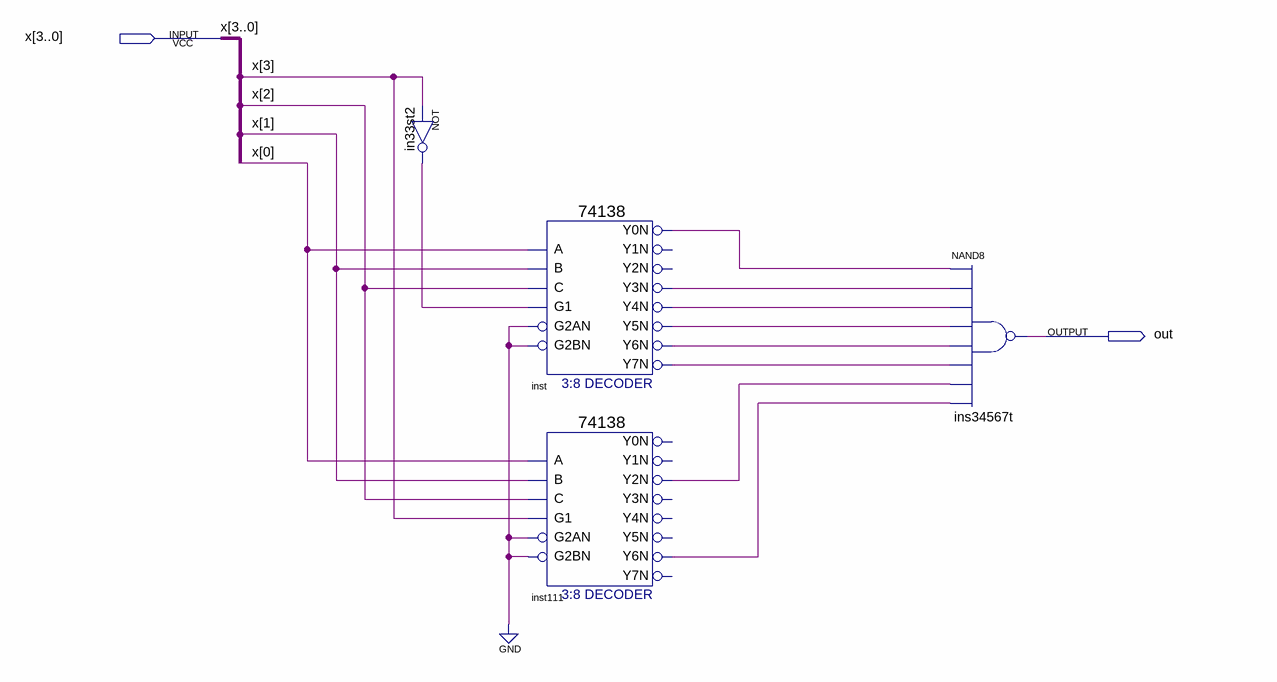
[diagram p0: schematic sheet]
// Quartus schematic Pract2.bdf as structural Verilog: 4 symbols, 2 pins
module Pract2 (
  input  [3:0] x,
  output out
);

  wire in33st2_out, inst111_y2n, inst111_y6n, inst_y0n, inst_y3n, inst_y4n, inst_y5n, inst_y6n, inst_y7n;

  not in33st2 (in33st2_out, x[3]);
  \74138  inst (
    .A(x[0]), .B(x[1]), .G1(in33st2_out), .C(x[2]), .G2AN(1'b0), .G2BN(1'b0), .Y0N(inst_y0n), .Y3N(inst_y3n),
    .Y4N(inst_y4n), .Y5N(inst_y5n), .Y6N(inst_y6n), .Y7N(inst_y7n));  // open: Y1N, Y2N
  \74138  inst111 (
    .A(x[0]), .B(x[1]), .G1(x[3]), .C(x[2]), .G2AN(1'b0), .G2BN(1'b0), .Y2N(inst111_y2n), .Y6N(inst111_y6n));  // open: Y0N, Y1N, Y3N, Y4N, Y5N, Y7N
  nand ins34567t (out, inst_y0n, inst_y3n, inst_y4n, inst_y5n, inst_y6n, inst_y7n, inst111_y2n, inst111_y6n);
endmodule
